# EAGLE design nixieClock (EAGLE 7.7.0)
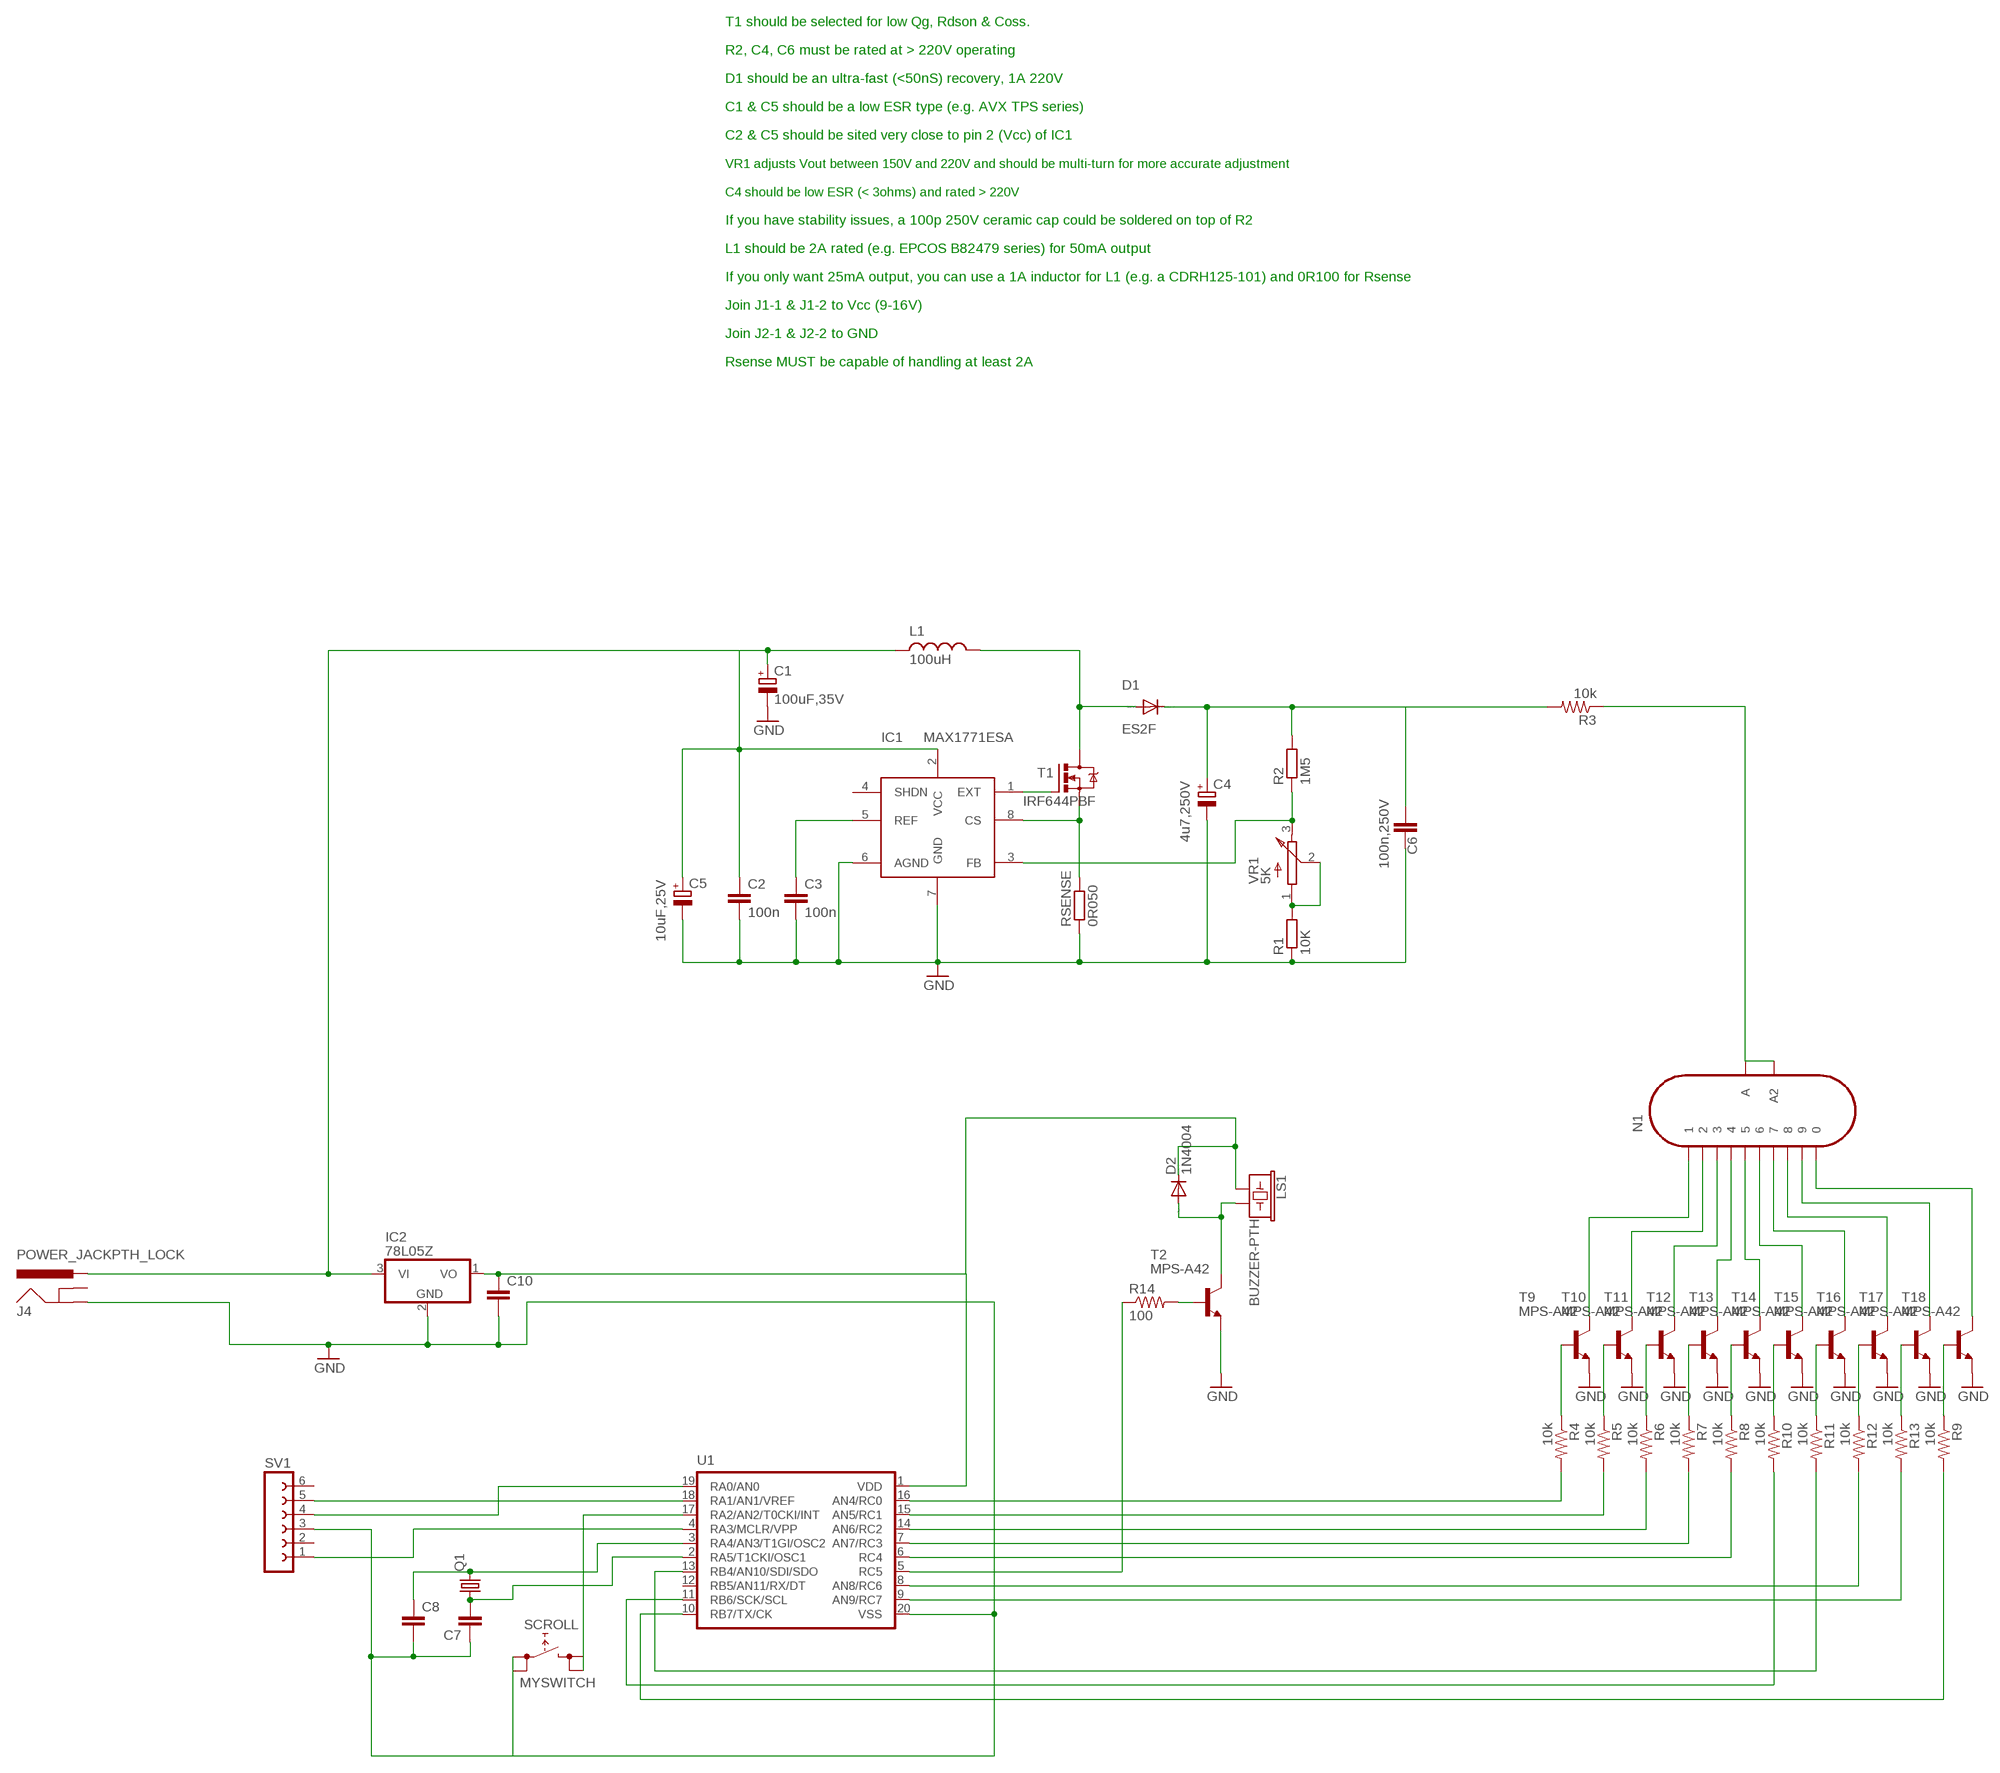
[diagram p0: schematic, sheet 1]

## Parts
C1  100uF,35V  C-POL-EU7343  [C-EIA-7343]
C2  100n  C-EUC0805  [C0805]
C3  100n  C-EUC0805  [C0805]
C4  4u7,250V  C-POL-EU-NICHICON-UJ-12  [NICHICON-UJ-12]
C5  10uF,25V  C-POL-EU7343  [C-EIA-7343]
C6  100n,250V  C-EU-2420  [C2420]
C7  C2,5-3  [C2.5-3]
C8  C2,5-3  [C2.5-3]
C10  C2,5-3  [C2.5-3]
D1  ES2F  DIODE-SMC  [SMC]
D2  1N4004  [DO41-10]
IC1  MAX1771ESA  [SO-8]
IC2  78L05Z  [TO92]
J4  POWER_JACKPTH_LOCK  [POWER_JACK_PTH_LOCK]
L1  100uH  L-SMT-POWER-B82479  [L-B82479]
LS1  BUZZER-PTH  [BUZZER-12MM]
N1  IN-18  [IN-18]
Q1  CRYSTALTC26V  [TC26V]
R1  10K  R-EU_R0805  [R0805]
R2  1M5  R-EU_R2512  [R2512]
R3  10k  R-US_0207/2V  [0207/2V]
R4  10k  R-US_0207/2V  [0207/2V]
R5  10k  R-US_0207/2V  [0207/2V]
R6  10k  R-US_0207/2V  [0207/2V]
R7  10k  R-US_0207/2V  [0207/2V]
R8  10k  R-US_0207/2V  [0207/2V]
R9  10k  R-US_0207/2V  [0207/2V]
R10  10k  R-US_0207/2V  [0207/2V]
R11  10k  R-US_0207/2V  [0207/2V]
R12  10k  R-US_0207/2V  [0207/2V]
R13  10k  R-US_0207/2V  [0207/2V]
R14  100  R-US_0207/2V  [0207/2V]
RSENSE  0R050  R-EU_R2010  [R2010]
SCROLL  MYSWITCH  [MYSWITCH]
SV1  FE06-1  [FE06]
T1  IRF644PBF  IRF740  [TO220BV]
T2  MPS-A42  MPSA42-NPN-TO92-CBE  [TO92-CBE]
T9  MPS-A42  MPSA42-NPN-TO92-CBE  [TO92-CBE]
T10  MPS-A42  MPSA42-NPN-TO92-CBE  [TO92-CBE]
T11  MPS-A42  MPSA42-NPN-TO92-CBE  [TO92-CBE]
T12  MPS-A42  MPSA42-NPN-TO92-CBE  [TO92-CBE]
T13  MPS-A42  MPSA42-NPN-TO92-CBE  [TO92-CBE]
T14  MPS-A42  MPSA42-NPN-TO92-CBE  [TO92-CBE]
T15  MPS-A42  MPSA42-NPN-TO92-CBE  [TO92-CBE]
T16  MPS-A42  MPSA42-NPN-TO92-CBE  [TO92-CBE]
T17  MPS-A42  MPSA42-NPN-TO92-CBE  [TO92-CBE]
T18  MPS-A42  MPSA42-NPN-TO92-CBE  [TO92-CBE]
U1  PIC16F6XX  [DIL20]
VR1  5K  TRIMPOT-3214W  [BOURNS-3214W]

## Nets
EXT: IC1.1(EXT) T1.G
GND: C1.- C2.2 C3.2 C4.1(-) C5.- C6.P$2 C7.1 C8.2 C10.2 IC1.6(AGND) IC1.7(GND) IC2.2(GND) J4.GND R1.1 RSENSE.1 SCROLL.A0 SCROLL.A1 SV1.3 T2.E T9.E T10.E T11.E T12.E T13.E T14.E T15.E T16.E T17.E T18.E U1.20(VSS)
N$1: N1.1 T9.C
N$2: IC1.8(CS) RSENSE.2 T1.S
N$3: R1.2 VR1.1(A) VR1.2(W)
N$4: SV1.1 U1.4(RA3/MCLR/VPP)
N$5: R8.2 U1.6(RC4)
N$7: R4.1 T9.B
N$8: IC1.3(FB) R2.1 VR1.3(B)
N$9: R5.1 T10.B
N$10: R4.2 U1.16(AN4/RC0)
N$11: R5.2 U1.15(AN5/RC1)
N$12: R6.2 U1.14(AN6/RC2)
N$13: R7.2 U1.7(AN7/RC3)
N$14: SV1.4 U1.19(RA0/AN0)
N$15 [power]: D1.A L1.P$2 T1.D
N$16: SV1.5 U1.18(RA1/AN1/VREF)
N$17: C3.1 IC1.5(REF)
N$18: R14.1 U1.5(RC5)
N$19: R12.2 U1.8(AN8/RC6)
N$20: R6.1 T11.B
N$21: R13.2 U1.9(AN9/RC7)
N$22: R7.1 T12.B
N$23: R8.1 T13.B
N$24: C7.2 Q1.1 U1.2(RA5/T1CKI/OSC1)
N$25: R10.1 T14.B
N$26: C8.1 Q1.2 U1.3(RA4/AN3/T1GI/OSC2)
N$27: R11.1 T15.B
N$28: R12.1 T16.B
N$29: R13.1 T17.B
N$30: C10.1 D2.C IC2.1(VO) LS1.+ U1.1(VDD)
N$31: R9.1 T18.B
N$32: R10.2 U1.11(RB6/SCK/SCL)
N$33: R9.2 U1.10(RB7/TX/CK)
N$34: SCROLL.B0 SCROLL.B1 U1.17(RA2/AN2/T0CKI/INT)
N$35: N1.2 T10.C
N$39: R11.2 U1.13(RB4/AN10/SDI/SDO)
N$40: D2.A LS1.- T2.C
N$41: R14.2 T2.B
N$45: N1.3 T11.C
N$46: N1.4 T12.C
N$47: N1.5 T13.C
N$48: N1.6 T14.C
N$49: N1.7 T15.C
N$50: N1.8 T16.C
N$51: N1.9 T17.C
N$52: N1.0 T18.C
N$54: N1.A N1.A2 R3.1
PWR [power]: C1.+ C2.1 C5.+ IC1.2(VCC) IC2.3(VI) J4.PWR L1.P$1
VOUT [power]: C4.2(+) C6.P$1 D1.C R2.2 R3.2
Unconnected: IC1.4(SHDN) J4.GNDBREAK SV1.2 SV1.6 U1.12(RB5/AN11/RX/DT)

## Notes on the sheet
- T1 should be selected for low Qg, Rdson & Coss.
- R2, C4, C6 must be rated at > 220V operating
- D1 should be an ultra-fast (<50nS) recovery, 1A 220V
- C1 & C5 should be a low ESR type (e.g. AVX TPS series)
- C2 & C5 should be sited very close to pin 2 (Vcc) of IC1
- VR1 adjusts Vout between 150V and 220V and should be multi-turn for more accurate adjustment
- C4 should be low ESR (< 3ohms) and rated > 220V
- If you have stability issues, a 100p 250V ceramic cap could be soldered on top of R2
- L1 should be 2A rated (e.g. EPCOS B82479 series) for 50mA output
- If you only want 25mA output, you can use a 1A inductor for L1 (e.g. a CDRH125-101) and 0R100 for Rsense
- Join J1-1 & J1-2 to Vcc (9-16V)
- Join J2-1 & J2-2 to GND
- Rsense MUST be capable of handling at least 2A

## Library data of the parts
C1 C5 = nick:C-POL-EU7343: Capacitor, Tantalum, EU 7343 case, polarised
C2 C3 = rcl:C-EU: CAPACITOR, European symbol
C4 = nick:C-POL-EU: Capacitor, Tantalum, EU 7343 case, polarised
C6 = nick:C-EU
C7 C8 C10 = capacitor-wima:C: CAPACITOR naming: grid - package width
D1 = diode:DIODE-: DIODE
D2 = diode:1N4004: DIODE general purpose rectifier, 1 A
IC1 = nick:MAX1771
IC2 = linear:78*: Positive VOLTAGE REGULATOR Source: http://cache.national.com/ds/LM/LM78L05.pdf http://www.fairchildsemi.com/ds/LM/LM7805.pdf
J4 = SparkFun-Connectors:POWER_JACK: Power Jack This is the standard 5.5mm barrel jack for power. The PTH is the most common, proven, reliable, footprint. The Slot footprint only works if the mill layer is transmitted to the PCB fab house so be warned. Mating wall wart : TOL-00298 (and others); PROD_ID: CONN-08197; SF_ID: PRT-00119
L1 = nick:L-SMT-POWER: SMT power inductors
LS1 = SparkFun-Electromechanical:BUZZER: Buzzer Small round buzzers that operate around the audible 2kHz range. You can use these as speakers to create simple music or user interfaces. Variant Overview: PTH - Mini Speaker - PC Mount 12mm 2.048kHz <https://www.sparkfun.com/products/7950> PTH_KIT - Mini Speaker - PC Mount 12mm 2.048kHz <https://www.sparkfun.com/products/7950> KIT simplifies soldering by adding stop mask to one side of the pads. PTH_NO_SILK - Mini Speaker - PC Mount 12mm 2.048kHz <https://www.sparkfun.com/products/7950> No silkscreen indicator of buzzer outline. PTH_KIT_NO_SILK - Mini Speaker - PC Mount 12mm 2.048kHz <https://www.sparkfun.com/products/7950> KIT package w/o silkscreen SMD - Buzzer Audio Magnetic (CCV-084B16) SMD buzzer used on, e.g. the LilyPad Buzzer <https://www.sparkfun.com/products/8463> and RFID USB Reader <https://www.sparkfun.com/products/9963>. SMD_KIT - Buzzer Audio Magnetic (CCV-084B16) SMD Buzzer with elongated pins to make soldering easier. Used on the SparkFun Simon Says - Surface Mount Soldering Kit <https://www.sparkfun.com/products/10935>.; PROD_ID: COMP-08253; SF_SKU: COM-07950
N1 = russian-nixies:IN-18: IN-18: large numeric frontview nixie tube
Q1 = crystal:CRYSTAL: CRYSTAL; OC_FARNELL: unknown; OC_NEWARK: unknown
R1 R2 RSENSE = rcl:R-EU_: RESISTOR, European symbol
R3-R14 = resistor:R-US_: RESISTOR, American symbol
SCROLL = switch:MYSWITCH
SV1 = con-lsta:FE06-1: FEMALE HEADER; OC_FARNELL: unknown; OC_NEWARK: unknown
T1 = transistor-power:IRF740: N-CHANNEL MOS FET
T2 T9-T18 = transistor:*-NPN-: NPN Transistror BF959 corrected 2008.03.06
U1 = pic16f690:PIC16F6XX
VR1 = nick:TRIMPOT

## Net classes
1 power: width 0.762 mm, clearance 0.508 mm

## Board
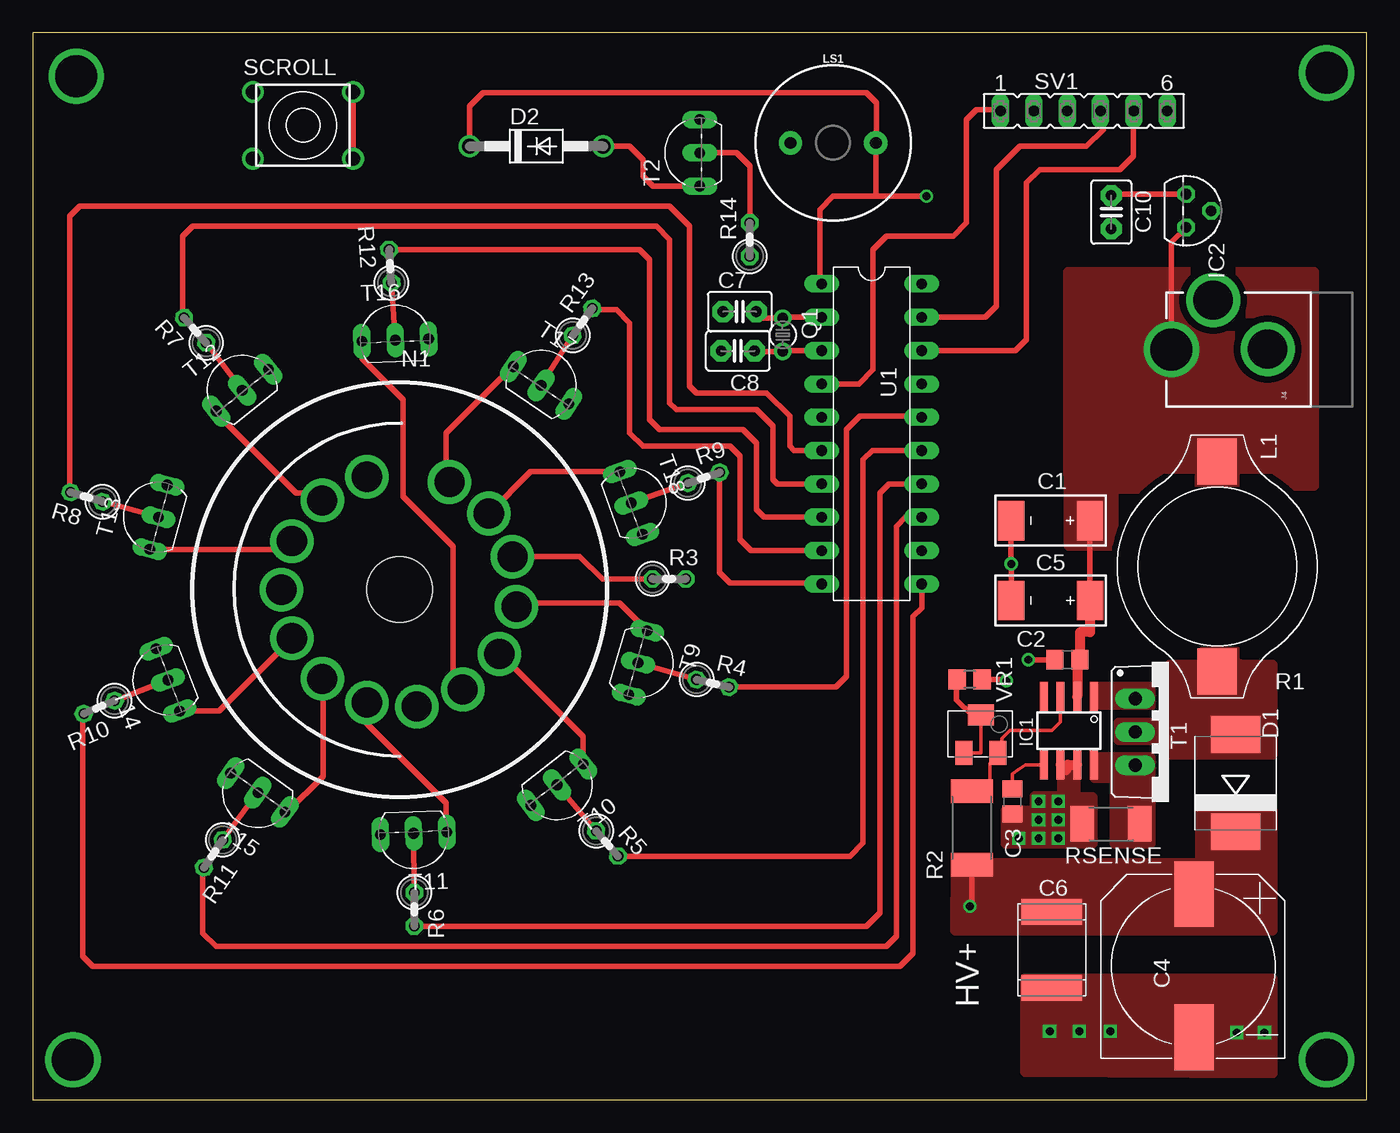
[diagram p1: board, top side]
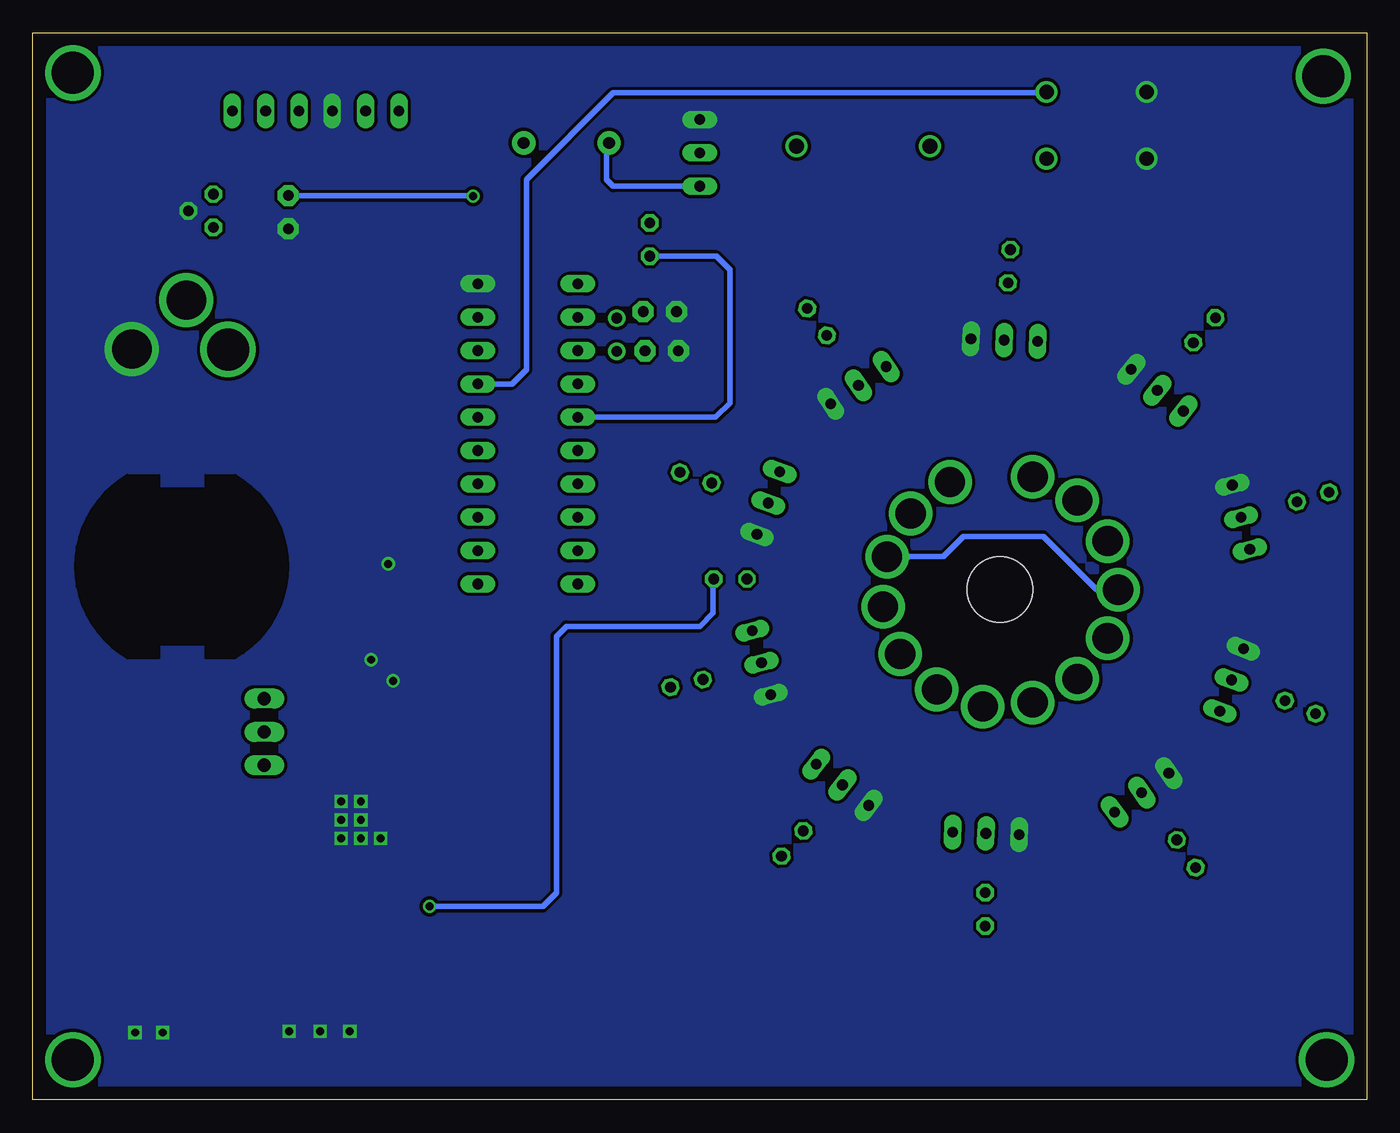
[diagram p2: board, bottom side, seen from below]

Size 101.6 x 81.28 mm. Coordinates in mm from the lower left corner, seen from the top.
Outline: 0,0 101.6,0 101.6,81.28 0,81.28 0,0
Copper layers (1*16): Top 0.035mm / dielectric 1.5mm / Bottom 0.035mm
Design rules "Olimex 10mils *": minimum track width 10mil, minimum drill 0.6mm, track to track 10mil, track to pad 10mil, pad to pad 10mil, via to via 10mil, smd to smd 10mil, copper to edge 40mil, drill to drill 10mil, minimum pad ring 10mil, minimum via ring 8mil, stop-mask expansion 0mil, vias tented up to drill 0mil, thermal gap 10mil

### Footprints (pad centres in the part's own frame; a part is rotated, then mirrored left to right if it is on the bottom)
C-EIA-7343 = smd 2 x 3: + -3,0; - 3,0
C0805 = smd 1.3 x 1.5: 1 -0.95,0; 2 0.95,0
NICHICON-UJ-12 = smd 3 x 5: 1 -2.4,-7.6; 2 -2.4,3.3
C2420 = smd 2 x 4.6: P$1 2.9,0; P$2 -2.9,0
C2.5-3 = drill 0.813 pad 1.6 octagon: 1 -1.27,0; 2 1.27,0
SMC = smd 2.8 x 3.8: A 3.7,0; C -3.7,0
DO41-10 = drill 1.118: A 5.08,0; C -5.08,0
SO-8 = smd 0.6 x 2.2: 1 -1.905,-2.6; 2 -0.635,-2.6; 3 0.635,-2.6; 4 1.905,-2.6; 5 1.905,2.6; 6 0.635,2.6; 7 -0.635,2.6; 8 -1.905,2.6
TO92 = drill 0.813 octagon: 1 -1.27,0; 2 0,1.905; 3 1.27,0
POWER_JACK_PTH_LOCK = drill 2.997 pad 4.115: GND 0.025,6.557; GNDBREAK 3.762,10.7 | drill 3.2 pad 4.115: PWR 0,13.878
L-B82479 = smd 3.5 x 3: P$1 -8,0; P$2 8,0
BUZZER-12MM = drill 0.9 pad 1.778: + 3.25,0; - -3.25,0
IN-18 = drill 2.3 pad 3.2: 0 5.8,-6.8; 1 -1.3,-8.9; 2 -4.9,-7.6; 3 -8.6,2.5; 4 6.8,5.9; 5 3.7,8.2; 6 -3.7,8.2; 7 -6.8,5.9; 8 -7.6,-4.8; 9 8.2,-3.8; A 0,9; A2 2.5,-8.6; N/C 8.6,2.5; N/C2 -8.9,-1.3 | hole 5: 0,0
TC26V = drill 0.813: 1 -1.27,0; 2 1.27,0
R0805 = smd 1.3 x 1.5: 1 -0.95,0; 2 0.95,0
R2512 = smd 1.8 x 3.2: 1 -2.8,0; 2 2.8,0
0207/2V = drill 0.813 octagon: 1 -1.27,0; 2 1.27,0
R2010 = smd 1.8 x 2.7: 1 -2.2,0; 2 2.2,0
MYSWITCH = drill 1.1: A0 -3.81,-2.54; A1 -3.81,2.54; B0 3.81,-2.54; B1 3.81,2.54
FE06 = drill 0.813 long: 1 -6.35,0; 2 -3.81,0; 3 -1.27,0; 4 1.27,0; 5 3.81,0; 6 6.35,0
TO220BV = drill 1.016 long: D 0,-2.54; G -2.54,-2.54; S 2.54,-2.54
TO92-CBE = drill 0.813 long: B 0,0; C -2.54,0; E 2.54,0
DIL20 = drill 0.813 long: 1 -11.43,-3.81; 2 -8.89,-3.81; 3 -6.35,-3.81; 4 -3.81,-3.81; 5 -1.27,-3.81; 6 1.27,-3.81; 7 3.81,-3.81; 8 6.35,-3.81; 9 8.89,-3.81; 10 11.43,-3.81; 11 11.43,3.81; 12 8.89,3.81; 13 6.35,3.81; 14 3.81,3.81; 15 1.27,3.81; 16 -1.27,3.81; 17 -3.81,3.81; 18 -6.35,3.81; 19 -8.89,3.81; 20 -11.43,3.81
BOURNS-3214W = smd 1.8 x 1.3: 1 1.4,-1.3; 3 1.4,1.3 | smd 1.6 x 2: 2 -1.5,0

### Placement (x,y rotation side)
C1  77.51,44.12 180 top
C2  78.81,33.52 180 top
C3  74.61,22.72 270 top
C4  90.84,12.36 0 top
C5  77.52,38.03 180 top
C6  77.61,11.42 90 top
C7  53.84,60.04 0 top
C8  53.7,57.05 180 top
C10  82.14,67.62 270 top
D1  91.61,24.12 90 top
D2  38.35,72.64 0 top
IC1  78.91,28.12 180 top
IC2  87.85,67.72 270 top
J4  100.61,57.16 90 top
L1  90.21,40.62 270 top
LS1  60.96,72.9 0 top
N1  27.94,38.86 90 top
Q1  57.12,58.28 270 top
R1  71.36,32.02 180 top
R2  71.51,20.72 270 top
R3  48.47,39.68 0 top
R4  51.8,31.73 346.8 top
R5  43.74,19.52 310.8 top
R6  29.05,14.51 270 top
R7  12.36,58.62 131.5 top
R8  4.09,45.91 163.8 top
R9  51.1,47.39 18.6 top
R10  5.06,29.91 202.8 top
R11  13.75,18.75 235.8 top
R12  27.23,63.5 94 top
R13  41.86,59.26 54 top
R14  54.61,65.53 90 top
RSENSE  82.11,21.02 0 top
SCROLL  20.58,74.23 0 top
SV1  80.06,75.32 0 top
T1  86.51,28.02 270 top
T2  50.8,72.14 90 top
T9  46.1,33.3 254 top
T10  39.93,24 218 top
T11  29,20.29 182 top
T12  15.95,54.05 38.7 top
T13  9.57,44.38 74.8 top
T14  10.29,31.99 110.8 top
T15  17.13,23.4 144.4 top
T16  27.61,57.87 2 top
T17  38.71,54.44 326 top
T18  45.57,45.46 290 top
U1  63.9,50.73 270 top
VR1  72.21,27.82 270 top

### Tracks (layer width: path | path; a pad name or v marks a point on that pad's centre or on a via)
EXT
  pour Top (no thermals): 85.31,31.62 85.31,29.92 80.71,29.92 80.71,31.62
GND  (via drill 0.6, 0.6 pad 1.02)
  Top 0.406: C1.- v74.51,40.84 v74.52,40.83 C5.- | R1.1 74.06,32.02 v74.16,31.92 | C2.2 v75.83,33.52
  Top 0.762: IC1.6 78.31,25.42 78.41,25.12 | 78.71,25.12 78.71,25.42 78.81,25.52 IC1.7
  other vias: 78.11,22.72 76.61,21.32 75.11,19.92 76.61,19.92 78.11,19.92 78.11,21.32 76.61,22.72 82.07,5.22 79.71,5.22 77.46,5.22 91.71,5.12 93.81,5.12
  pour Bottom (isolate 0.01, rank 3, no thermals): 101.08,80.83 101.08,0.5 0.51,0.5 0.51,80.83
  pour Top (rank 2, no thermals): 94.41,9.22 94.41,2.02 75.61,2.12 75.61,9.22
  pour Top (no thermals): 78.41,25.12 79.41,25.12 79.41,23.02 80.71,23.02 80.71,19.52 74.11,19.52 74.11,22.02 76.31,22.02 76.31,23.12 78.41,23.12
N$1
  Top 0.406: T9.C 44.7,37.85 37.12,37.85 N1.1
N$2
  pour Top (no thermals): 80.91,26.1 85.11,26.1 85.11,19.52 82.41,19.52 82.41,24.52 80.91,24.52
N$3
  Top 0.254: VR1.1 72.21,26.42 VR1.2
  Top 0.406: VR1.2 71.51,29.32 70.36,30.48 70.36,31.97 R1.2
N$4
  Top 0.406: U1.4 62.92,54.54 64.01,55.63 64.01,64.77 65.02,65.79 70.1,65.79 71.12,66.8 71.12,74.68 71.88,75.44 73.59,75.44 SV1.1
N$5
  Top 0.406: U1.6 57.98,49.46 57.66,49.78 57.66,52.07 55.88,53.85 50.55,53.85 50.04,54.36 50.04,66.55 48.51,68.07 3.56,68.07 2.79,67.31 2.79,46.34 R8.2
N$6  (via drill 3.2)
  other vias: 98.55,78.23
N$7
  Top 0.406: T9.B R4.1
N$8
  Top 0.254: IC1.3 78.28,28.79 77.61,28.12 74.41,28.12 73.81,27.52 73.81,26.42 VR1.3 72.91,25.62 72.91,24.32 R2.1
N$9
  Top 0.406: T10.B R5.1
N$10
  Top 0.406: R4.2 61.16,31.44 61.98,32.26 61.98,51.05 62.99,52.07 67.64,52.07 U1.16
N$11
  Top 0.406: U1.15 63.94,49.46 63.25,48.77 63.25,19.56 62.23,18.54 44.59,18.54 R5.2
N$12
  Top 0.406: U1.14 65.2,46.92 64.52,46.23 64.52,14.22 63.5,13.21 29.09,13.21 R6.2
N$13
  Top 0.406: R7.2 11.43,59.66 11.43,65.79 12.19,66.55 47.5,66.55 48.51,65.53 48.51,53.09 49.02,52.58 55.12,52.58 56.39,51.31 56.39,47.24 56.72,46.92 U1.7
N$14
  Top 0.406: U1.19 72.57,59.62 73.41,60.45 73.41,70.87 75.18,72.64 80.26,72.64 81.53,73.91 81.53,75.12 SV1.4
N$15
  pour Top (rank 2, no thermals): 91.71,33.12 94.41,33.12 94.41,26.32 86.61,26.32 86.61,27.42 82.71,27.42 82.71,28.72 86.61,28.72 86.61,33.12 89.11,33.12 89.11,34.12 91.71,34.12
N$16
  Top 0.406: U1.18 74.86,57.08 75.69,57.91 75.69,69.85 76.71,70.87 82.8,70.87 83.82,71.88 83.82,75.28 SV1.5
N$17
  Top 0.254: C3.1 74.61,24.82 75.01,25.12 75.61,25.52 IC1.5
N$18
  Bottom 0.406: U1.5 49.6,52 48.51,53.09 48.51,63.25 49.53,64.26 R14.1
N$19
  Top 0.406: U1.8 55.7,44.38 55.12,44.96 55.12,50.04 54.1,51.05 47.75,51.05 46.99,51.82 46.99,64.01 46.23,64.77 R12.2
N$20
  Top 0.406: T11.B R6.1
N$21
  Top 0.406: U1.9 54.68,41.84 53.85,42.67 53.85,49.02 53.09,49.78 46.48,49.78 45.47,50.8 45.47,59.18 44.45,60.2 42.7,60.2 R13.2
N$22
  Top 0.406: R7.1 T12.B
N$23
  Top 0.406: R8.1 T13.B
N$24
  Top 0.406: U1.2 57.19,59.62 Q1.1 55.61,59.55 C7.2
N$25
  Top 0.406: T14.B R10.1
N$26
  Top 0.406: U1.3 57.19,57.08 Q1.2 55.02,57.01 C8.1
N$27
  Top 0.406: T15.B R11.1
N$28
  Top 0.406: R12.1 T16.B
N$29
  Top 0.406: R13.1 T17.B
N$30  (via drill 0.6)
  Top 0.406: IC2.1 82.24,68.99 C10.1 | v68.07,68.83 64.26,68.83 | 64.26,68.83 60.96,68.83 59.94,67.82 59.94,62.3 U1.1 | 64.26,68.83 64.21,68.89 LS1.+ 64.26,72.95 64.26,75.95 63.5,76.71 34.29,76.71 33.27,75.69 D2.C
  Bottom 0.406: C10.1 68.13,68.89 v68.07,68.83
N$31
  Top 0.406: R9.1 T18.B
N$32
  Top 0.406: U1.11 67.71,37.48 67.06,36.83 67.06,11.18 66.04,10.16 4.57,10.16 3.81,10.92 3.81,29.34 R10.2
N$33
  Top 0.406: R9.2 52.3,40.15 53.09,39.37 60.02,39.37 U1.10
N$34
  Top 0.406: SCROLL.B1 SCROLL.B0
  Bottom 0.406: U1.17 65.1,54.54 64.01,55.63 64.01,70.1 57.4,76.71 24.46,76.71 SCROLL.B1
N$35
  Top 0.406: N1.2 35.63,33.96 41.91,27.69 41.91,25.59 T10.C
N$36  (via drill 3.2)
  other vias: 98.55,3.05
N$37  (via drill 3.2)
  other vias: 3.05,3.05
N$38  (via drill 3.2)
  other vias: 3.3,77.98
N$39
  Top 0.406: U1.13 66.47,44.38 65.79,43.69 65.79,12.45 65.02,11.68 13.97,11.68 12.95,12.7 12.95,17.61 R11.2
N$40
  Top 0.406: D2.A 45.47,72.64 46.48,71.63 46.48,70.36 47.24,69.6 T2.C
  Bottom 0.406: T2.C 57.4,69.6 57.91,70.1 57.91,72.7 LS1.-
N$41
  Top 0.406: R14.2 54.61,71.12 53.59,72.14 T2.B
N$45
  Top 0.406: N1.3 25.44,28.66 31.5,22.61 31.5,20.43 T11.C
N$46
  Top 0.406: T12.C 13.97,52.33 20.07,46.23 21.47,46.23 N1.4
N$47
  Top 0.406: T13.C 19.11,41.93 N1.5
N$48
  Top 0.406: T14.C 14.19,29.62 N1.6
N$49
  Top 0.406: T15.C 19.38,21.92 22.1,24.64 22.1,32 N1.7
N$50
  Top 0.406: T16.C 25.07,56.46 28.19,53.34 28.19,45.97 32,42.16 32,32 N1.8
N$51
  Top 0.406: T17.C 36.55,55.86 31.5,50.8 31.5,47.31 N1.9
N$52
  Top 0.406: T18.C 37.92,47.84 N1.0
N$54
  Top 0.406: R3.1 43.38,39.68 41.66,41.4 36.58,41.4 N1.A2
  Bottom 0.406: N1.A 20.57,38.86 24.64,42.93 30.73,42.93 32.26,41.4 36.5,41.4 N1.A2
PWR
  Top 0.406: C5.+ 80.52,44.11 C1.+ | J4.PWR 86.73,65.33 IC2.3
  Top 0.762: C5.+ 80.52,35.62 79.76,35.62 C2.1 79.55,33.52 IC1.2
  pour Top (isolate 0.01, rank 2, no thermals): 78.91,47.62 78.91,42.22 82.31,42.22 82.31,46.52 97.56,46.78 97.56,63.05 78.87,63.05 78.87,47.62
VOUT  (via drill 0.6)
  Top 0.406: R2.2 71.51,14.87 v71.37,14.73
  Bottom 0.406: v71.37,14.73 62.74,14.73 61.72,15.75 61.72,35.31 60.96,36.07 50.8,36.07 49.78,37.08 49.78,39.63 R3.2
  pour Top (isolate 0.01, rank 2, no thermals): 94.41,22.02 94.41,12.92 70.27,12.92 70.31,18.02 88.91,18.02 88.91,22.02

### Text on the board
tPlace: HV+
Measures: 0.000 | 0.146 | 1.839 | 1.655 | 1.512 | 1.508 | 0.154 | 0.000 | 0.000 | 0.001 | 0.000 | 0.001 | 0.000 | 0.000 | 1.209 | 2.026